# EAGLE schematic Airowl_Schematic (EAGLE 6.5.0)
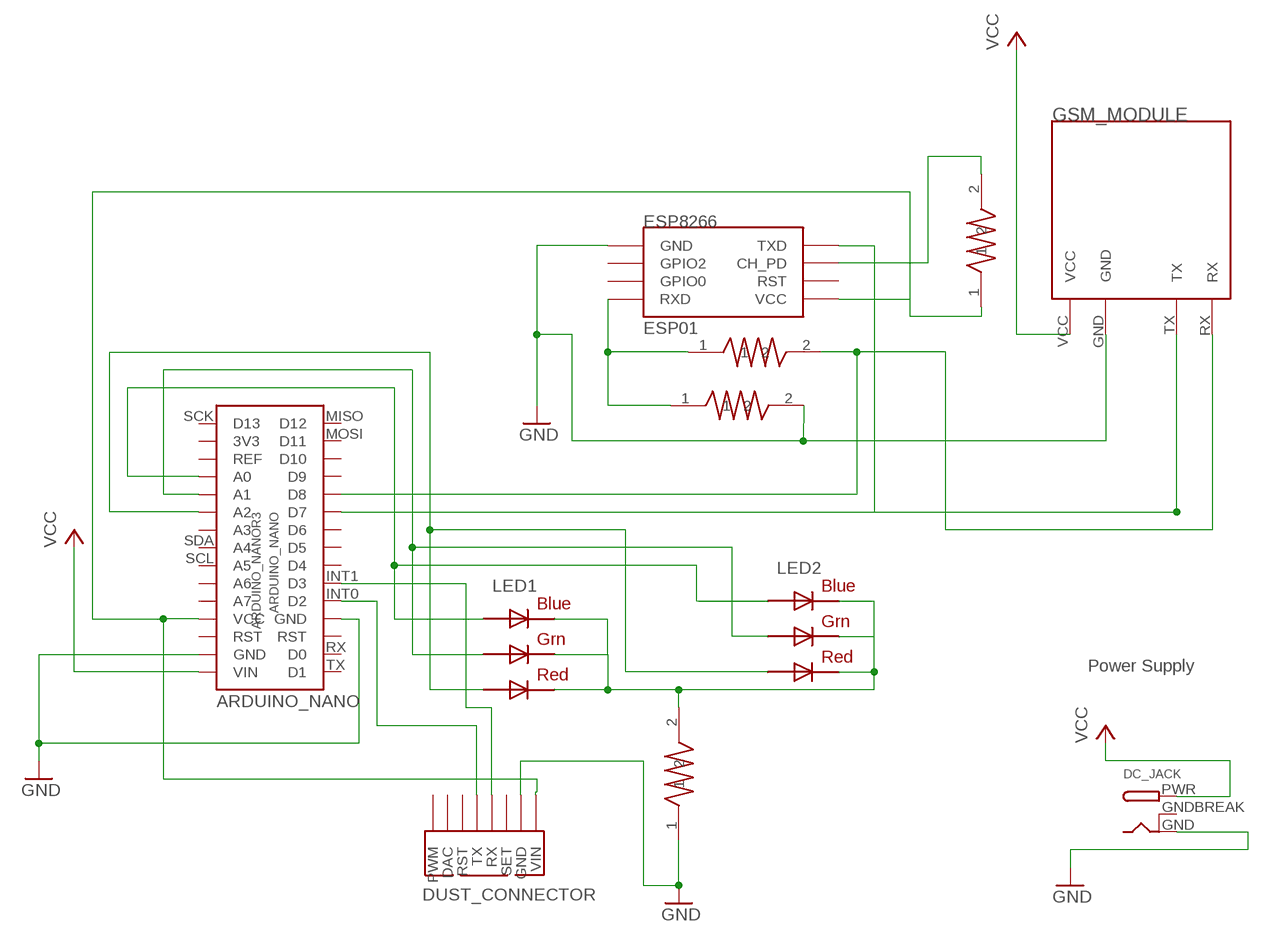
[diagram p0: schematic, sheet 1]

## Parts
ARDUINO_NANO  ARDUINO_NANOR3  [ARDUINO-NANO]
DC_JACK  DCBARRELPTH  [DCJACK_2MM_PTH]
DUST_CONNECTOR  WINSEN_CONNECTOR  [WINSEN_CONNECTOR]
ESP8266  ESP01  [ESP01]
GSM_MODULE  GSM900_MODULE  [GSM900_MODULE]
LED1  RGBLED5050  [RGBLED5050]
LED2  RGBLED5050  [RGBLED5050]
R1  RESISTOR(HORIZONTAL)  [RESISTER(HORIZONTAL)]
R2  RESISTOR(HORIZONTAL)  [RESISTER(HORIZONTAL)]
R3  RESISTOR(HORIZONTAL)  [RESISTER(HORIZONTAL)]
R4  RESISTOR(HORIZONTAL)  [RESISTER(HORIZONTAL)]

## Nets
GND: ARDUINO_NANO.GND@1(GND) ARDUINO_NANO.GND@2(GND) DC_JACK.GND DUST_CONNECTOR.P$8(GND) ESP8266.GND GSM_MODULE.GND R1.1 R3.2
N$1: ARDUINO_NANO.A0 LED1.3(BLUE_A) LED2.3(BLUE_A)
N$2: ARDUINO_NANO.A1 LED1.1(GREEN_A) LED2.1(GREEN_A)
N$3: ARDUINO_NANO.A2 LED1.2(RED_A) LED2.2(RED_A)
N$6: LED1.4(BLUE_C) LED1.5(RED_C) LED1.6(GREEN_C) LED2.4(BLUE_C) LED2.5(RED_C) LED2.6(GREEN_C)
N$8: ARDUINO_NANO.INT0(D2) DUST_CONNECTOR.P$5(TX)
N$9: ARDUINO_NANO.VCC DUST_CONNECTOR.P$9(VIN) ESP8266.VCC R4.1
N$10: ARDUINO_NANO.INT1(D3) DUST_CONNECTOR.P$6(RX)
N$11: ESP8266.RX(RXD) R2.1 R3.1
N$12: ARDUINO_NANO.D8 GSM_MODULE.RX R2.2
N$13: ESP8266.CH_PD R4.2
N$14: ARDUINO_NANO.D7 ESP8266.TX(TXD) GSM_MODULE.TX
VCC: ARDUINO_NANO.VIN DC_JACK.PWR GSM_MODULE.VCC
Unconnected: ARDUINO_NANO.A3 ARDUINO_NANO.A6 ARDUINO_NANO.A7 ARDUINO_NANO.D4 ARDUINO_NANO.D5 ARDUINO_NANO.D6 ARDUINO_NANO.D9 ARDUINO_NANO.D10 ARDUINO_NANO.MISO(D12) ARDUINO_NANO.MOSI(D11) ARDUINO_NANO.REF ARDUINO_NANO.RST@1(RST) ARDUINO_NANO.RST@2(RST) ARDUINO_NANO.RX(D0) ARDUINO_NANO.SCK(D13) ARDUINO_NANO.SCL(A5) ARDUINO_NANO.SDA(A4) ARDUINO_NANO.TX(D1) DUST_CONNECTOR.P$2(PWM) DUST_CONNECTOR.P$3(DAC) DUST_CONNECTOR.P$4(RST) DUST_CONNECTOR.P$7(SET) ESP8266.GPIO0 ESP8266.GPIO2 ESP8266.RST R1.2

## Notes on the sheet
- Power Supply

## Power pins joined to a net without a drawn wire
3V3: ARDUINO_NANO.3V3
GNDBREAK: DC_JACK.GNDBREAK

## Library data of the parts
ARDUINO_NANO = Aldar:ARDUINO_NANO: Arduino NANO R3
DC_JACK = adafruit:DCBARREL: 2.0mm DC Barrel Jack DCJACK_2MM_PTH - Through Hole Jack (4UConnector: 05537)
DUST_CONNECTOR = Wnisen:WINSEN_CONNECTOR
ESP8266 = esp8266modules:ESP01: ESP8266 Wifi module 01
GSM_MODULE = OIZOM:GSM900_MODULE
LED1 LED2 = adafruit:RGBLED: For 5050 RGB LEDs, the order of the LEDs may vary from one manufacturer to another!
R1-R4 = ROBOCON_:RESISTOR(HORIZONTAL)